# EAGLE design MedidorEnergia (EAGLE 7.7.0)
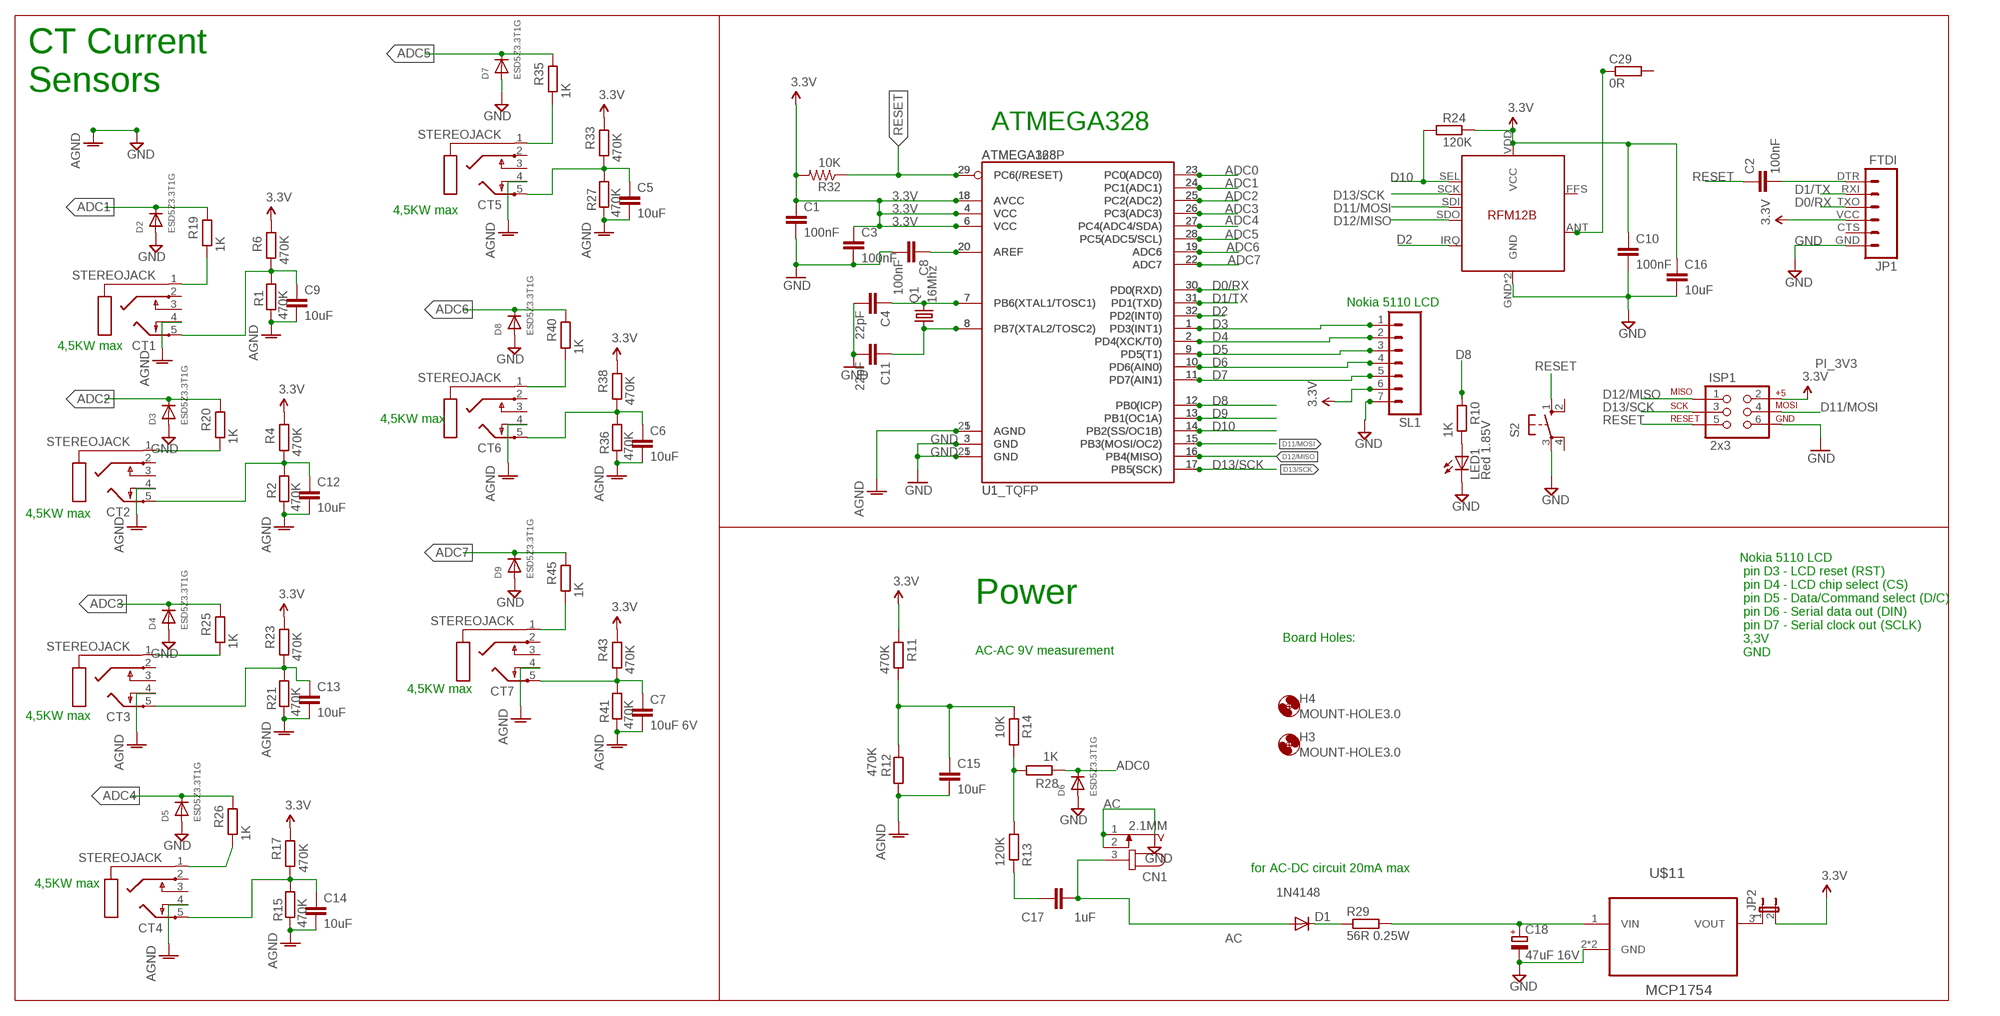
[diagram p0: schematic, sheet 1]

## Parts
C1  100nF  C-EUC0603  [C0603]
C2  100nF  C-EUC0603  [C0603]
C3  100nF  C-EUC0603  [C0603]
C4  22pF  C-EUC0603  [C0603]
C5  10uF  C-EUC0805  [C0805]
C6  10uF  C-EUC0805  [C0805]
C7  10uF 6V  C-EUC0805  [C0805]
C8  100nF  C-EUC0603  [C0603]
C9  10uF  C-EUC0805  [C0805]
C10  100nF  C-EUC0603  [C0603]
C11  22pF  C-EUC0603  [C0603]
C12  10uF  C-EUC0805  [C0805]
C13  10uF  C-EUC0805  [C0805]
C14  10uF  C-EUC0805  [C0805]
C15  10uF  C-EUC1206  [C1206]
C16  10uF  C-EUC1206  [C1206]
C17  1uF  C-EUC0805  [C0805]
C18  47uF 16V  CPOL-EUD  [PANASONIC_D]
C29  0R  R-EU_R0603  [R0603]
CN1  2.1MM  JACK-PLUG0  [SPC4077]
CT1  STEREOJACK  [STX3100]
CT2  STEREOJACK  [STX3100]
CT3  STEREOJACK  [STX3100]
CT4  STEREOJACK  [STX3100]
CT5  STEREOJACK  [STX3100]
CT6  STEREOJACK  [STX3100]
CT7  STEREOJACK  [STX3100]
D1  1N4148  DIODESOD  [SOD-323]
D2  ESD5Z3.3T1G  DIODESOD-523  [SOD-523]
D3  ESD5Z3.3T1G  DIODESOD-523  [SOD-523]
D4  ESD5Z3.3T1G  DIODESOD-523  [SOD-523]
D5  ESD5Z3.3T1G  DIODESOD-523  [SOD-523]
D6  ESD5Z3.3T1G  DIODESOD-523  [SOD-523]
D7  ESD5Z3.3T1G  DIODESOD-523  [SOD-523]
D8  ESD5Z3.3T1G  DIODESOD-523  [SOD-523]
D9  ESD5Z3.3T1G  DIODESOD-523  [SOD-523]
H3  MOUNT-HOLE3.0  [3,0]
H4  MOUNT-HOLE3.0  [3,0]
ISP1  2x3  AVR_SPI_PRG_6PTH  [2X3]
JP1  FTDI  FTDI_BASICPTH  [FTDI_BASIC]
JP2  JUMPER-2PTH_LOCK  [1X02_LOCK]
LED1  Red 1.85V  LEDCHIP-LED0805  [CHIP-LED0805]
Q1  16Mhz  CRYSTALHC49S  [HC49/S]
R1  470K  R-EU_R0603  [R0603]
R2  470K  R-EU_R0603  [R0603]
R4  470K  R-EU_R0603  [R0603]
R6  470K  R-EU_R0603  [R0603]
R10  1K  R-EU_R0603  [R0603]
R11  470K  R-EU_R0603  [R0603]
R12  470K  R-EU_R0603  [R0603]
R13  120K  R-EU_R0603  [R0603]
R14  10K  R-EU_R0603  [R0603]
R15  470K  R-EU_R0603  [R0603]
R17  470K  R-EU_R0603  [R0603]
R19  1K  R-EU_R0603  [R0603]
R20  1K  R-EU_R0603  [R0603]
R21  470K  R-EU_R0603  [R0603]
R23  470K  R-EU_R0603  [R0603]
R24  120K  R-EU_R0603  [R0603]
R25  1K  R-EU_R0603  [R0603]
R26  1K  R-EU_R0603  [R0603]
R27  470K  R-EU_R0603  [R0603]
R28  1K  R-EU_R0603  [R0603]
R29  56R 0.25W  R-EU_R1206  [R1206]
R32  10K  R-US_R0603  [R0603]
R33  470K  R-EU_R0603  [R0603]
R35  1K  R-EU_R0603  [R0603]
R36  470K  R-EU_R0603  [R0603]
R38  470K  R-EU_R0603  [R0603]
R40  1K  R-EU_R0603  [R0603]
R41  470K  R-EU_R0603  [R0603]
R43  470K  R-EU_R0603  [R0603]
R45  1K  R-EU_R0603  [R0603]
S2  10-XX  [B3F-10XX]
SL1  M07  [07P]
U1  ATMEGA168  [TQFP32-08]
U1_TQFP  ATMEGA328P  ATMEGA328_SMT  [TQFP32-08]
U$11  MCP1754  [SOT89]
U$14  RFM12B  [RFM12B]

## Nets
3.3V: C1.1 C3.1 C10.1 C16.1 ISP1.2 JP1.VCC JP2.2 R4.2 R6.2 R11.2 R17.2 R23.2 R24.2 R32.2 R33.2 R38.2 R43.2 SL1.6 U1.4(VCC) U1.6(VCC) U1.18(AVCC) U1_TQFP.4(VCC) U1_TQFP.6(VCC) U1_TQFP.18(AVCC) U$14.VDD(VCC)
AC: C17.2 CN1.3 D1.2(A)
ADC0: D6.K(C) R28.1 U1.23(PC0(ADC0)) U1_TQFP.23(PC0(ADC0))
ADC1: D2.K(C) R19.2 U1.24(PC1(ADC1)) U1_TQFP.24(PC1(ADC1))
ADC2: D3.K(C) R20.2 U1.25(PC2(ADC2)) U1_TQFP.25(PC2(ADC2))
ADC3: D4.K(C) R25.2 U1.26(PC3(ADC3)) U1_TQFP.26(PC3(ADC3))
ADC4: D5.K(C) R26.2 U1.27(PC4(ADC4/SDA)) U1_TQFP.27(PC4(ADC4/SDA))
ADC5: D7.K(C) R35.2 U1.28(PC5(ADC5/SCL)) U1_TQFP.28(PC5(ADC5/SCL))
ADC6: D8.K(C) R40.2 U1.19(ADC6) U1_TQFP.19(ADC6)
ADC7: D9.K(C) R45.2 U1.22(ADC7) U1_TQFP.22(ADC7)
AGND [gnd]: C5.2 C6.2 C7.2 C9.2 C12.2 C13.2 C14.2 C15.2 CT1.4 CT2.4 CT3.4 CT4.4 CT5.4 CT6.4 CT7.4 R1.2 R2.2 R12.1 R15.2 R21.2 R27.2 R36.2 R41.2 U1.5(AGND) U1_TQFP.21(AGND)
D0/RX: JP1.TXO U1.30(PD0(RXD)) U1_TQFP.30(PD0(RXD))
D1/TX: JP1.RXI U1.31(PD1(TXD)) U1_TQFP.31(PD1(TXD))
D2: U1.32(PD2(INT0)) U1_TQFP.32(PD2(INT0)) U$14.IRQ
D3: SL1.1 U1.1(PD3(INT1)) U1_TQFP.1(PD3(INT1))
D4: SL1.2 U1.2(PD4(XCK/T0)) U1_TQFP.2(PD4(XCK/T0))
D5: SL1.3 U1.9(PD5(T1)) U1_TQFP.9(PD5(T1))
D6: SL1.4 U1.10(PD6(AIN0)) U1_TQFP.10(PD6(AIN0))
D7: SL1.5 U1.11(PD7(AIN1)) U1_TQFP.11(PD7(AIN1))
D8: R10.2 U1.12(PB0(ICP)) U1_TQFP.12(PB0(ICP))
D9: U1.13(PB1(OC1A)) U1_TQFP.13(PB1(OC1A))
D10: R24.1 U1.14(PB2(SS/OC1B)) U1_TQFP.14(PB2(SS/OC1B)) U$14.SEL
D11/MOSI: ISP1.4 U1.15(PB3(MOSI/OC2)) U1_TQFP.15(PB3(MOSI/OC2)) U$14.SDI
D12/MISO: ISP1.1 U1.16(PB4(MISO)) U1_TQFP.16(PB4(MISO)) U$14.SDO
D13/SCK: ISP1.3 U1.17(PB5(SCK)) U1_TQFP.17(PB5(SCK)) U$14.SCK
GND [gnd]: C1.2 C3.2 C4.2 C8.2 C10.2 C11.2 C16.2 C18.- CN1.1 CN1.2 D2.A D3.A D4.A D5.A D6.A D7.A D8.A D9.A ISP1.6 JP1.GND LED1.C S2.3(P) SL1.7 U1.3(GND) U1.21(GND) U1_TQFP.3(GND) U1_TQFP.5(GND) U$11.2(GND) U$11.2.1(GND) U$14.GND U$14.P$12(GND) ; supply symbol labelled AGND
N$1: C4.1 Q1.2 U1.7(PB6(XTAL1/TOSC1)) U1_TQFP.7(PB6(XTAL1/TOSC1))
N$2: CT1.1 R19.1
N$3: C13.1 CT3.5 R21.1 R23.1
N$4: R13.2 R14.1 R28.2
N$5: JP2.1 U$11.3(VOUT)
N$6: C18.+ R29.2 U$11.1(VIN)
N$7: C17.1 R13.1
N$8: CT4.1 R26.1
N$9: C11.1 Q1.1 U1.8(PB7(XTAL2/TOSC2)) U1_TQFP.8(PB7(XTAL2/TOSC2))
N$10: CT2.1 R20.1
N$11: C29.1 U$14.ANT
N$12: D1.1(C) R29.1
N$13: CT3.1 R25.1
N$17: C5.1 CT5.5 R27.1 R33.1
N$18: CT5.1 R35.1
N$20: C8.1 U1.20(AREF) U1_TQFP.20(AREF)
N$21: C6.1 CT6.5 R36.1 R38.1
N$22: CT6.1 R40.1
N$23: C2.2 JP1.DTR
N$25: C7.1 CT7.5 R41.1 R43.1
N$26: CT7.1 R45.1
N$33: C12.1 CT2.5 R2.1 R4.1
N$34: C15.1 R11.1 R12.2 R14.2
N$37: C14.1 CT4.5 R15.1 R17.1
N$38: C9.1 CT1.5 R1.1 R6.1
N$41: LED1.A R10.1
RESET: C2.1 ISP1.5 R32.1 S2.1(S) U1.29(PC6(/RESET)) U1_TQFP.29(PC6(/RESET))
Unconnected: C29.2 CT1.2 CT1.3 CT2.2 CT2.3 CT3.2 CT3.3 CT4.2 CT4.3 CT5.2 CT5.3 CT6.2 CT6.3 CT7.2 CT7.3 JP1.CTS S2.2(S1) S2.4(P1) U$14.FFS

## Notes on the sheet
- CT Current 
  Sensors
- ATMEGA328
- 4,5KW max
- Nokia 5110 LCD
- 4,5KW max
- 4,5KW max
- 4,5KW max
- Power
- Board Holes:
- AC-AC 9V measurement
- Nokia 5110 LCD
   pin D3 - LCD reset (RST)
   pin D4 - LCD chip select (CS)
   pin D5 - Data/Command select (D/C)
   pin D6 - Serial data out (DIN)
   pin D7 - Serial clock out (SCLK)
   3,3V
   GND
- 4,5KW max
- 4,5KW max
- for AC-DC circuit 20mA max
- 4,5KW max

## Library data of the parts
C1 C2 C10 = rcl:C-EU: CAPACITOR, European symbol; MF: YAGEO (PHYCOMP); MPN: CC0603MRY5V9BB104; OC_FARNELL: 431989
C3 C8 = resistor:C-EU: CAPACITOR, European symbol; MF: YAGEO (PHYCOMP); MPN: CC0603MRY5V9BB104; OC_FARNELL: 431989
C4 C11 = resistor:C-EU: CAPACITOR, European symbol; MF: YAGEO (PHYCOMP); MPN: CC0603JRNPO9BN220; OC_FARNELL: 722005
C5-C7 C9 C12-C15 = resistor:C-EU: CAPACITOR, European symbol; MF: AVX; MPN: TAJC106K025RNJ; OC_FARNELL: 197518
C16 = rcl:C-EU: CAPACITOR, European symbol; MF: AVX; MPN: TAJC106K025RNJ; OC_FARNELL: 197518
C17 = resistor:C-EU: CAPACITOR, European symbol; MF: AVX; MPN: 08055C104KAT2A; OC_FARNELL: 499687
C18 = resistor:CPOL-EU: POLARIZED CAPACITOR, European symbol; MF: PANASONIC ELECTRONIC COMPONENTS; MPN: EEEFC1C470AP; OC_FARNELL: 1244352
C29 = resistor:R-EU_: RESISTOR, European symbol; OC_FARNELL: unknown
CN1 = con-jack:JACK-PLUG: DC POWER JACK Power Jack, DC, Right Angle, Through Hole, Rated 5A at 16VDC, PC Terminals Distributor: Farnell (www.Farnell.de) Drawing: 84N1161.pdf / 84N1162.pdf Manufacturer: SPC Technology (www.spctechnology.com) Type: SPC4077 / SPC 4078; MF: MULTICOMP; MPN: SPC21364; OC_FARNELL: 1654842; OC_NEWARK: unknown
CT1-CT7 = adafruit:STEREOJACK: MIC/HEADPHONE JACK Stereo jack with two switches. Kycon STX3100, CUI SJ1-3555NG and/or 4UCon 05544; MF: CLIFF ELECTRONIC COMPONENTS; MPN: FC68131; OC_FARNELL: 2518188
D1 = SparkFun:DIODE: Diode; MF: MULTICOMP; MPN: 1N4148WS.; OC_FARNELL: 1466524
D2-D9 = microbuilder:DIODE: Diode; MF: ON SEMICONDUCTOR; MPN: ESD5Z3.3T1G; OC_FARNELL: 2317508
H3 H4 = holes:MOUNT-HOLE: MOUNTING HOLE with drill center marker; OC_FARNELL: unknown
ISP1 = SparkFun:AVR_SPI_PRG_6: AVR ISP 6 Pin This is the reduced ISP connector for AVR programming. Common on Arduino. This footprint will take up less PCB space and can be used with a 10-pin to 6-pin adapter such as SKU: BOB-08508; MF: HARWIN; MPN: M20-9970346; OC_FARNELL: 1022226
JP1 = SparkFun:FTDI_BASIC: FTDI Basic: 3.3V and 5V; MF: MULTICOMP; MPN: 2212S-10SG-85; OC_FARNELL: 1593464
JP2 = SparkFun:JUMPER-2: Jumper Basic 0.1" spaced jumper. Use with breakaway headers.; OC_FARNELL: unknown
LED1 = adafruit:LED: LED OSRAM: - CHIPLED LG R971, LG N971, LY N971, LG Q971, LY Q971, LO R971, LY R971 LH N974, LH R974 LS Q976, LO Q976, LY Q976 LO Q996 - Hyper CHIPLED LW Q18S LB Q993, LB Q99A, LB R99A - SideLED LS A670, LO A670, LY A670, LG A670, LP A670 LB A673, LV A673, LT A673, LW A673 LH A674 LY A675 LS A676, LA A676, LO A676, LY A676, LW A676 LS A679, LY A679, LG A679 - Hyper Micro SIDELED® LS Y876, LA Y876, LO Y876, LY Y876 LT Y87S - SmartLED LW L88C, LW L88S LB L89C, LB L89S, LG L890 LS L89K, LO L89K, LY L89K LS L896, LA L896, LO L896, LY L896 - TOPLED LS T670, LO T670, LY T670, LG T670, LP T670 LSG T670, LSP T670, LSY T670, LOP T670, LYG T670 LG T671, LOG T671, LSG T671 LB T673, LV T673, LT T673, LW T673 LH T674 LS T676, LA T676, LO T676, LY T676, LB T676, LH T676, LSB T676, LW T676 LB T67C, LV T67C, LT T67C, LS T67K, LO T67K, LY T67K, LW E67C LS E67B, LA E67B, LO E67B, LY E67B, LB E67C, LV E67C, LT E67C LW T67C LS T679, LY T679, LG T679 LS T770, LO T770, LY T770, LG T770, LP T770 LB T773, LV T773, LT T773, LW T773 LH T774 LS E675, LA E675, LY E675, LS T675 LS T776, LA T776, LO T776, LY T776, LB T776 LHGB T686 LT T68C, LB T68C - Hyper Mini TOPLED® LB M676 - Mini TOPLED Santana® LG M470 LS M47K, LO M47K, LY M47K Source: http://www.osram.convergy.de/; MF: MULTICOMP; MPN: MCL-S270SRC; OC_FARNELL: 1581239
Q1 = adafruit:CRYSTAL: CRYSTAL; MF: MULTICOMP; MPN: HC49SM-3.6864-30-50-60-16-ATF; OC_FARNELL: 1667008; OC_NEWARK: unknown
R1 R2 R4 R6 R11 R12 R15 R17 R21 R23 R27 R33 R36 R38 R41 R43 = rcl:R-EU_: RESISTOR, European symbol; MF: YAGEO (PHYCOMP); MPN: RE0603DR-07470KL; OC_FARNELL: 1840598
R10 R19 R20 R25 R26 R28 R35 R40 R45 = rcl:R-EU_: RESISTOR, European symbol; MF: WELWYN; MPN: PCF0603R-1K0BT1; OC_FARNELL: 1160322
R13 R24 = rcl:R-EU_: RESISTOR, European symbol; MF: YAGEO (PHYCOMP); MPN: RT0603FRE07120KL; OC_FARNELL: 1500592
R14 = rcl:R-EU_: RESISTOR, European symbol; MF: WELWYN; MPN: PCF0603R-10KBT1; OC_FARNELL: 1160359
R29 = resistor:R-EU_: RESISTOR, European symbol; MF: VISHAY; MPN: CRCW120656R0JNEA; OC_FARNELL: 1570837
R32 = adafruit:R-US_: RESISTOR, American symbol; MF: WELWYN; MPN: PCF0603R-10KBT1; OC_FARNELL: 1160359
S2 = switch-omron:10-XX: OMRON SWITCH; MF: OMRON ELECTRONIC COMPONENTS; MPN: B3F-1000; OC_FARNELL: 176432; OC_NEWARK: 36M3542
SL1 = con-amp-quick:M07: AMP QUICK CONNECTOR; MF: HARWIN; MPN: M20-9991045; OC_FARNELL: 1022259; OC_NEWARK: unknown
U1 = SparkFun-DigitalIC:ATMEGA168: Atmel 32-pin 8-bit micro, 16k flash.; OC_FARNELL: unknown
U1_TQFP = SparkFun-DigitalIC:ATMEGA328_SMT: 32-Pin Atmega328 part Commonly used on Arduino compatible boards Available in QFP and QFN packages TQFP is IC-09069 QFN is non-stock; OC_FARNELL: unknown; PROD_ID: IC-09069
U$11 = OpenEnergyMonitor:MCP1754; MF: MICROCHIP; MPN: MCP1754ST-3302E/MB; OC_FARNELL: 2065847
U$14 = JeeParts:RFM12B; OC_FARNELL: unknown

## Net classes
0 default: width 0.203 mm, drill 0.6 mm, clearance 0.203 mm
1 power: width 0.305 mm, drill 0.6 mm, clearance 0.254 mm
2 gnd: width 0.254 mm, drill 0.6 mm, clearance 0.254 mm

## Board
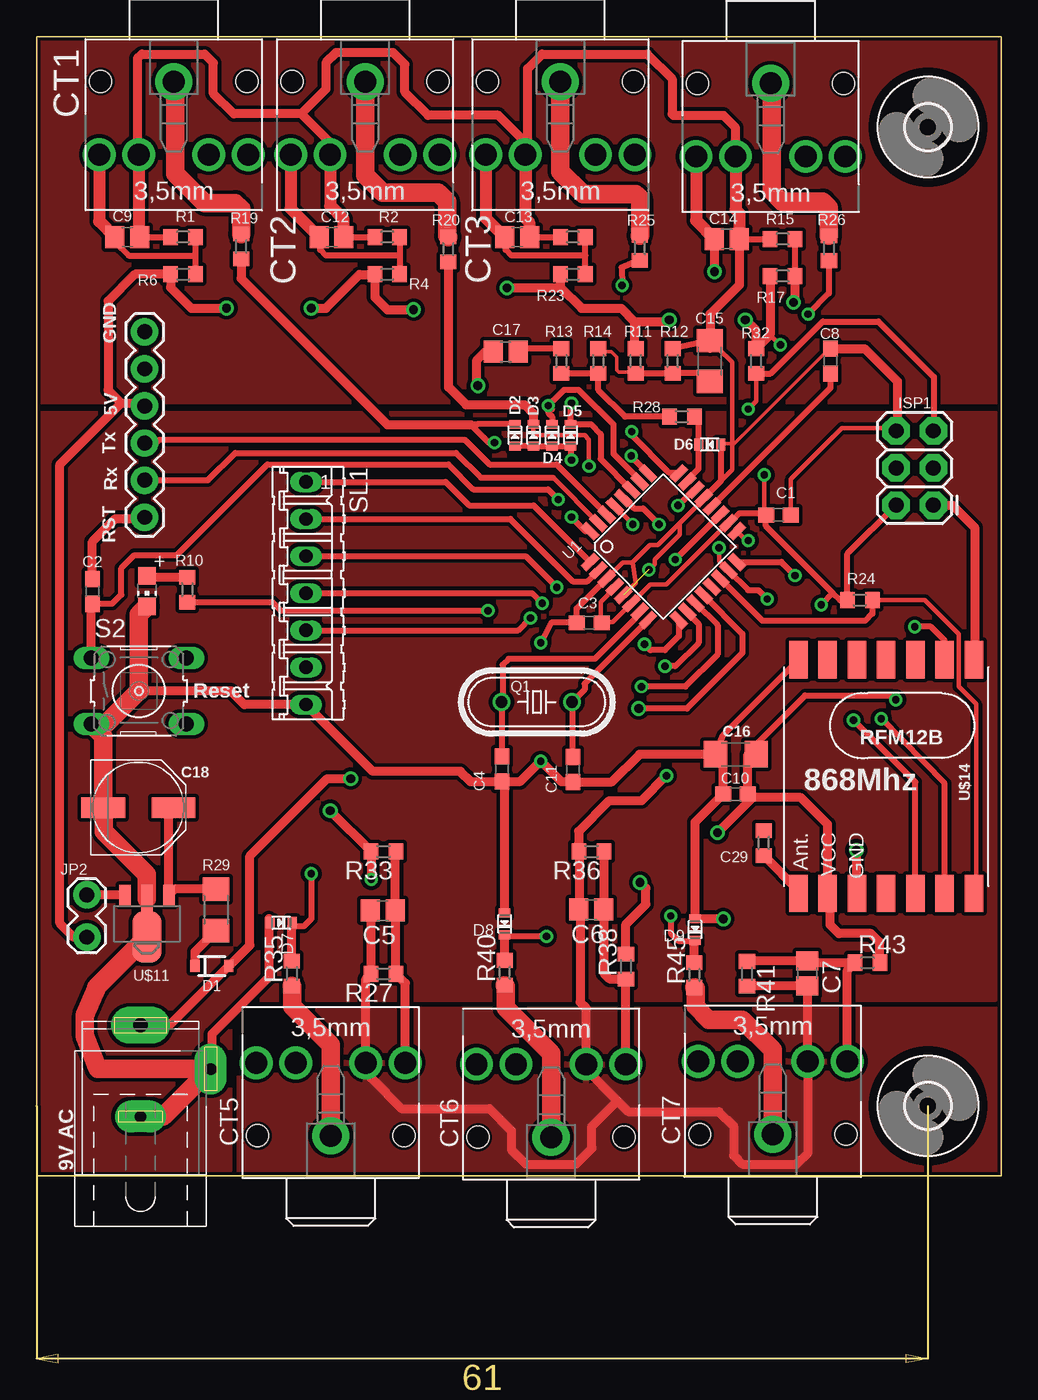
[diagram p1: board, top side]
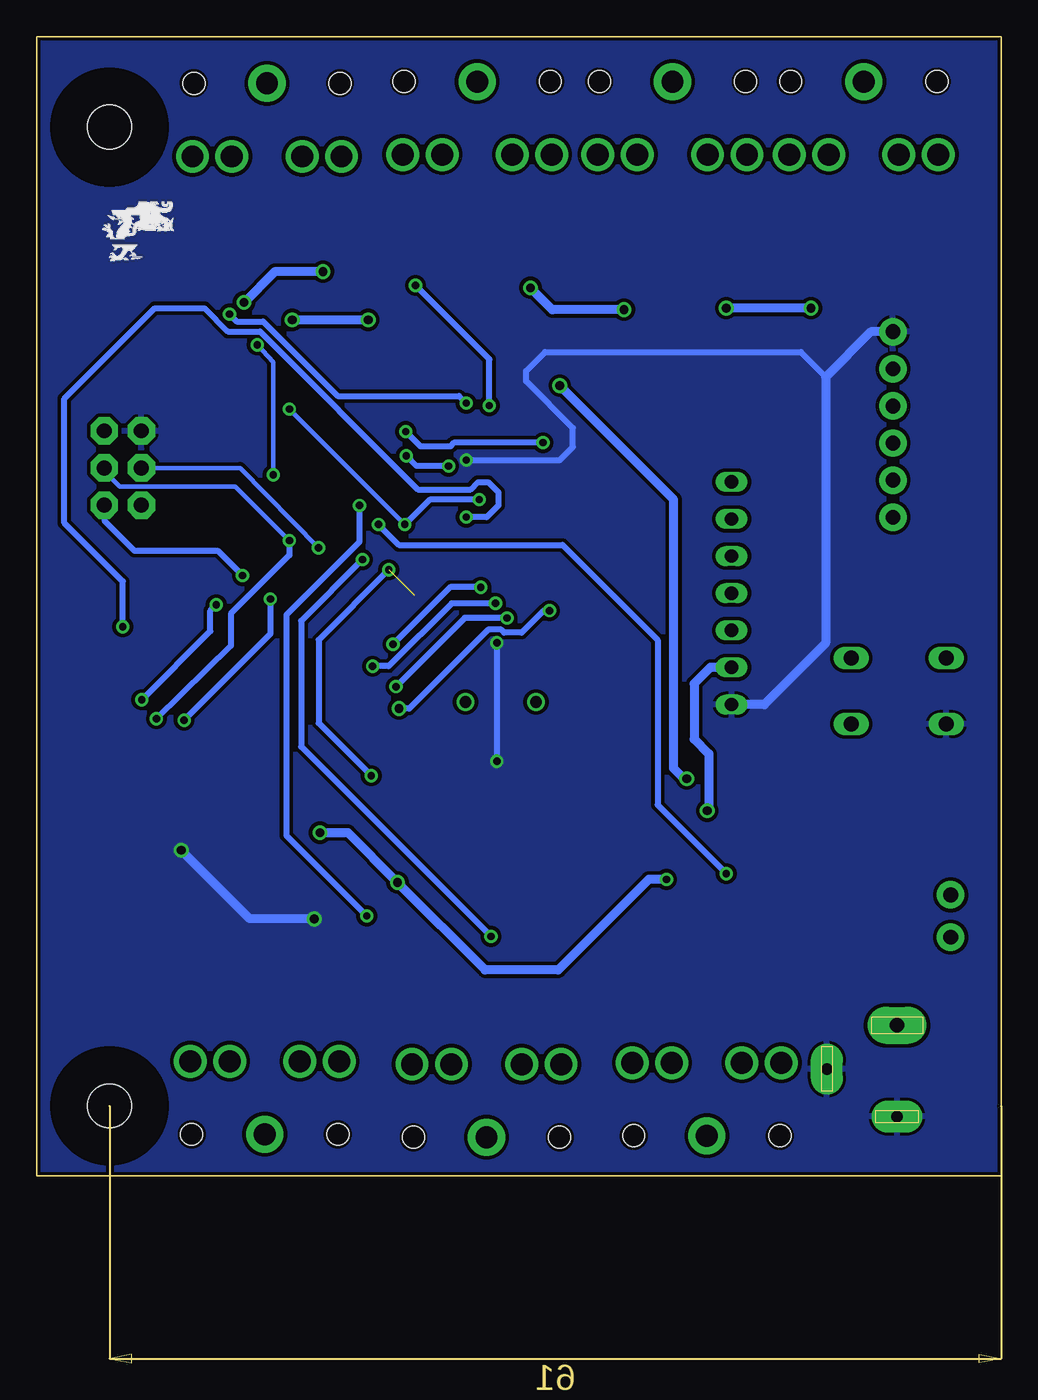
[diagram p2: board, bottom side, seen from below]

Size 66 x 78 mm. Coordinates in mm from the lower left corner, seen from the top.
Outline: 0,78 0,0 66,0 66,78 0,78
Copper layers (1*16): Top 0.035mm / dielectric 1.5mm / Bottom 0.035mm
Design rules "default *": minimum track width 8mil, minimum drill 0.5mm, track to track 8mil, track to pad 8mil, pad to pad 8mil, via to via 10mil, smd to smd 7mil, copper to edge 8mil, drill to drill 8mil, minimum pad ring 8mil, minimum via ring 8mil, stop-mask expansion 0.075mm, vias tented up to drill 0.6mm, thermal gap 8mil

### Footprints (pad centres in the part's own frame; a part is rotated, then mirrored left to right if it is on the bottom)
C0603 = smd 1.1 x 1: 1 -0.85,0; 2 0.85,0
C0805 = smd 1.3 x 1.5: 1 -0.85,0; 2 0.85,0
C1206 = smd 1.6 x 1.8: 1 -1.4,0; 2 1.4,0
PANASONIC_D = smd 3 x 1.4: + 2.4,0; - -2.4,0
R0603 = smd 1 x 1.1: 1 -0.85,0; 2 0.85,0
SPC4077 = drill 0.8 pad 2.184 long: 1 -3.25,0; 2 0,-4.8 | drill 1 pad 2.54 long: 3 3,0
STX3100 = drill 1.5 pad 2.54: 1 2.7,-0.1 | drill 1.5: 2 7.7,5; 3 7.7,2.3; 4 7.7,-2.5; 5 7.7,-5.2 | hole 1.5: 2.7,4.9; 2.7,-5.1
SOD-323 = smd 0.63 x 0.83: 1 -1.15,0; 2 1.15,0
SOD-523 = smd 0.8 x 0.6: A 0,-0.75; K 0,0.75
3,0 = hole 3: 0,0
2X3 = drill 1.016 pad 1.88 octagon: 1 0,0; 2 0,2.54; 3 2.54,0; 4 2.54,2.54; 5 5.08,0; 6 5.08,2.54
FTDI_BASIC = drill 1.016 pad 1.88: CTS 10.16,0; DTR 0,0; GND 12.7,0; RXI 2.54,0; TXO 5.08,0; VCC 7.62,0
1X02_LOCK = drill 1.016 pad 1.88: 1 -0.178,0; 2 2.718,0
CHIP-LED0805 = smd 1.2 x 1.2: A 0,-1.05; C 0,1.05
HC49/S = drill 0.813: 1 -2.413,0; 2 2.413,0
R1206 = smd 1.6 x 1.803: 1 -1.422,0; 2 1.422,0
B3F-10XX = drill 1.016 long: 1 -3.251,2.261; 2 3.251,2.261; 3 -3.251,-2.261; 4 3.251,-2.261
07P = drill 0.914 long: 1 -7.62,0; 2 -5.08,0; 3 -2.54,0; 4 0,0; 5 2.54,0; 6 5.08,0; 7 7.62,0
TQFP32-08 = smd 1.27 x 0.559: 1 -4.293,2.8; 2 -4.293,2; 3 -4.293,1.2; 4 -4.293,0.4; 5 -4.293,-0.4; 6 -4.293,-1.2; 7 -4.293,-2; 8 -4.293,-2.8; 17 4.293,-2.8; 18 4.293,-2; 19 4.293,-1.2; 20 4.293,-0.4; 21 4.293,0.4; 22 4.293,1.2; 23 4.293,2; 24 4.293,2.8 | smd 0.559 x 1.27: 9 -2.8,-4.293; 10 -2,-4.293; 11 -1.2,-4.293; 12 -0.4,-4.293; 13 0.4,-4.293; 14 1.2,-4.293; 15 2,-4.293; 16 2.8,-4.293; 25 2.8,4.293; 26 2,4.293; 27 1.2,4.293; 28 0.4,4.293; 29 -0.4,4.293; 30 -1.2,4.293; 31 -2,4.293; 32 -2.8,4.293
SOT89 = smd 0.8 x 1.4: 1 -1.499,-1.981; 3 1.499,-1.981 | smd 0.8 x 1.9: 2 0,-1.727 | smd 2 x 3.5: 2.1 0,0.889
RFM12B = smd 2.54 x 1.27: ANT 8,-6; FFS -8,2; GND 8,-2; IRQ -8,4; P$8 -8,0; P$9 -8,-2; P$10 -8,-4; P$12 -8,-6; P$16 8,0; SCK 8,4; SDI 8,2; SDO -8,6; SEL 8,6; VDD 8,-4

### Placement (x,y rotation side)
C1  50.77,45.24 0 top
C2  3.83,40.02 90 top
C3  37.81,37.88 180 top
C4  31.84,27.86 270 top
C5  23.69,18.17 180 top
C6  37.97,18.24 180 top
C7  52.73,13.87 270 top
C8  54.33,55.78 90 top
C9  6.22,64.27 0 top
C10  47.83,26.15 180 top
C11  36.72,27.82 270 top
C12  20.19,64.27 0 top
C13  32.89,64.27 0 top
C14  47.24,64.14 0 top
C15  46.07,55.79 90 top
C16  47.85,28.86 180 top
C17  32.1,56.42 180 top
C18  6.97,25.22 0 top
C29  49.75,22.79 90 top
CN1  7.12,7.32 90 top
CT1  9.49,77.62 270 top
CT2  22.58,77.62 270 top
CT3  35.95,77.62 270 top
CT4  50.33,77.49 270 top
CT5  20.03,0.05 90 top
CT6  35.11,-0.05 90 top
CT7  50.28,0.15 90 top
D1  12,14.38 0 top
D2  32.73,50.7 0 top
D3  34.01,50.7 0 top
D4  35.27,50.7 0 top
D5  36.55,50.7 0 top
D6  46.07,50.07 90 top
D7  16.75,17.33 270 top
D8  32.03,17.25 180 top
D9  45.06,16.87 180 top
H3  61,71.8 0 top
H4  61,4.8 0 top
ISP1  61.37,45.92 90 top
JP1  7.4,45.09 90 top
JP2  3.45,19.07 270 top
LED1  7.56,40.03 180 top
Q1  34.23,32.44 180 top
R1  10.03,64.27 180 top
R2  24,64.27 180 top
R4  24,61.73 180 top
R6  10.03,61.73 180 top
R10  10.32,40.12 270 top
R11  40.99,55.79 90 top
R12  43.53,55.79 270 top
R13  35.91,55.79 270 top
R14  38.45,55.79 90 top
R15  51.05,64.14 180 top
R17  51.05,61.6 180 top
R19  14,63.63 270 top
R20  28.17,63.43 270 top
R21  36.7,64.27 180 top
R23  36.7,61.73 180 top
R24  56.34,39.42 180 top
R25  41.27,63.53 270 top
R26  54.23,63.5 270 top
R27  23.74,13.84 180 top
R28  44.16,51.98 180 top
R29  12.28,18.22 90 top
R32  49.24,55.78 90 top
R33  23.74,22.21 180 top
R35  17.48,13.85 90 top
R36  37.97,22.21 180 top
R38  40.34,14.33 90 top
R40  32.03,13.91 90 top
R41  48.62,13.84 270 top
R43  56.86,14.6 0 top
R45  45.02,13.76 90 top
S2  7,33.2 0 top
SL1  18.44,39.89 270 top
U1  42.9,43.09 45 top
U1_TQFP  42.9,43.09 45 top
U$11  7.55,17.25 180 top
U$14  58.14,27.34 270 top

### Tracks (layer width: path | path; a pad name or v marks a point on that pad's centre or on a via)
3.3V  (via drill 0.5, 0.6)
  Top 0.305: 49.79,45.37 v49.79,47.99 v49.8,48 | v50.9,56.9 50.39,57.4 50.2,57.59 | 38.7,37.92 39.42,37.92 U1.6 42.01,40.5 43.1,40.5 47.31,44.71 | U1.4 39.58,40.28 38.6,39.3 38.6,37.94 C3.1
  Top 0.406: 38.7,37.92 C3.1 | ISP1.2 55.49,42.59 R24.2 54.98,39.42 54.5,39.9 | 54.5,39.9 49.9,44.5 49.9,45.23 C1.1 49.79,45.37 48.1,45.37 47.44,44.71 U1.18 47.31,44.71 | C16.1 48.7,29 52.6,32.9 58.5,32.9 v58.8,32.6 | 54.5,39.9 v53.7,39.1 | v22.89,20.31 v22.9,20.3
  Top 0.61: R17.2 50.2,57.59 R32.2 49.24,57.85 v48.5,58.6 | C16.1 48.68,28.84 C10.1 48.93,25.9 | R43.2 57.71,15.99 57.1,16.6 54.9,16.6 54.3,17.2 54.3,19.17 U$14.VDD 54.13,24.07 52.3,25.9 48.93,25.9 | 5.8,52.9 4.9,53.8 4.9,59.9 6.73,61.73 R6.2 9.18,60.82 10.6,59.4 v13,59.4 | 5.8,52.9 7.2,52.9 JP1.VCC | JP2.2 2.55,16.35 1.6,17.3 1.6,48.7 5.8,52.9 | v18.8,59.4 19.8,59.4 22.1,61.7 23.12,61.7 R4.2 23.15,60.15 24,59.3 v25.8,59.3 | R23.2 35.85,60.85 | 35.85,60.85 37.3,59.4 40,59.4 40.9,58.5 | 40.9,58.5 40.9,56.73 R11.2 | v32.2,60.8 35.8,60.8 35.85,60.85 | 40.9,58.5 43.2,58.5 v43.3,58.6 | v20.1,25 R33.2 v22.89,20.31 | 48.93,25.9 48.93,25.83 v46.6,23.5 | R38.2 40.34,17.24 41.7,18.6 41.7,19.7 v41.3,20.1
  Bottom 0.305: v49.8,48 49.8,55.7 v50.9,56.9
  Bottom 0.406: v58.8,32.6 54.1,37.3 54.1,38.7 v53.7,39.1
  Bottom 0.61: v13,59.4 v18.8,59.4 | v25.8,59.3 30.7,59.3 v32.2,60.8 | v43.3,58.6 v48.5,58.6 | v22.9,20.3 24.1,20.3 30.3,14.1 35.3,14.1 v41.3,20.1 44.7,23.5 v46.6,23.5 | SL1.6 19.89,34.81 21,33.7 21,29.9 20,28.9 20,25.1 v20.1,25
AC  (via drill 0.6)
  Top 0.61: CN1.3 9.09,10.32 D1.2 13.18,14.38 14.6,15.8 14.6,21.9 19.9,27.2 v21.5,27.2 | C17.2 30.72,56.42 30.1,55.8 30.1,54.2 v30.2,54.1
  Bottom 0.61: v21.5,27.2 21.7,27.2 22.4,27.9 22.4,46.3 v30.2,54.1
ADC0
  Top 0.406: U1.23 44.52,47.63 45.31,48.42 45.31,50.06 D6.K 45.32,51.67 R28.1
ADC1  (via drill 0.5)
  Top 0.406: v40.74,50.96 40.74,50.7 43.28,48.16 43.89,48.16 U1.24 | D2.K 30.18,51.45 29.74,51.41 30.96,50.2 v31.34,50.2
  Top 0.61: 29.74,51.41 24.03,51.41 14,61.44 R19.2
  Bottom 0.406: v31.34,50.2 37.43,50.2 37.69,49.94 39.72,49.94 v40.74,50.96
ADC2  (via drill 0.5)
  Top 0.305: D3.K 34.01,50.7 34,50.7 37.5,50.7 37.8,50.4 v37.8,48.6
  Top 0.406: v40.7,49.3 40.7,49.24 U1.25
  Top 0.61: D3.K 34,52.2 33.4,52.8 29.4,52.8 28.2,54 28.2,62.56 R20.2
  Bottom 0.406: v37.8,48.6 40,48.6 v40.7,49.3
ADC3  (via drill 0.5)
  Top 0.406: U1.26 41.27,47.63 39.47,49.44 39.47,51.47 38.45,52.48 38.32,52.58 37.1,53.8 36.08,53.8 v35.02,52.74 | R25.2 40.05,62.19 v40.07,60.97 | v35.02,52.74 35.02,52.23 35.27,51.98 D4.K | 35.27,52.48 v35.02,52.74
  Bottom 0.406: v40.07,60.97 36.67,57.56 35.02,55.91 v35.02,52.74
ADC4  (via drill 0.5)
  Top 0.406: U1.27 38.6,49.08 38.6,50.8 37.95,51.45 D5.K 36.55,52.84 v36.6,52.9 | R26.2 54.23,60.42 v52.8,59
  Bottom 0.406: v52.8,59 52.3,58.5 50.5,58.5 45.4,53.4 37.1,53.4 v36.6,52.9
ADC5  (via drill 0.5)
  Top 0.305: 17.33,17.1 D7.K
  Top 0.406: v18.8,20.7 18.8,17.6 18.3,17.1 17.33,17.1 | U1.28 40.2,46.4 40.9,45.7 41.5,45.7 v42.6,44.6
  Top 0.61: R35.2 17.48,16.96 D7.K
  Bottom 0.406: v42.6,44.6 41.2,43.2 30,43.2 23.5,36.7 23.5,25.4 v18.8,20.7
ADC6  (via drill 0.5)
  Top 0.406: U1.19 v43.7,42.2 | v34.9,16.4 32.13,16.4 D8.K
  Top 0.61: R40.2 D8.K
  Bottom 0.406: v43.7,42.2 47.9,38 47.9,29.4 v34.9,16.4
ADC7  (via drill 0.5)
  Top 0.305: U1.22
  Top 0.406: U1.22 44.97,46.97 v43.9,45.9 | v43.4,17.8 43.4,16.6 43.9,16.1 45.04,16.1 D9.K
  Top 0.61: R45.2 45.02,16.08 D9.K
  Bottom 0.406: v43.9,45.9 43.9,43.4 48.9,38.4 48.9,23.3 v43.4,17.8
AGND  (via drill 0.5)  (1 unrouted)
  Top 0.305: 46.36,56.64 C15.2 46.66,56.64 47.6,55.7 47.6,48.36 U1_TQFP.21 | 45.65,46.35 44,44.7 44,43.9 42.3,42.2 42.3,41.9 v41.9,41.5
  Top 0.406: C15.2 R12.1 | C14.2 R15.2 | C9.2 R1.2 | C13.2 R21.2 | C12.2 R2.2 | U1_TQFP.21 45.65,46.35 | U1.5 40.17,39.77
  Top 0.61: C14.2 48.09,60.99 46.1,59 46.1,56.67 C15.2 | R41.2 48.65,13.02 C7.2 52.78,12.97 CT7.4 52.8,7.84 52.8,1.6 52,0.8 48.3,0.8 47.7,1.4 47.7,3.4 46.7,4.4 40.5,4.4 39.75,5.15 | C5.2 22.89,18.12 R27.2 22.53,13.48 CT5.4 22.89,7.39 22.89,6.71 25,4.6 31,4.6 32.5,3.1 32.5,1.8 33.5,0.8 36.9,0.8 38,1.9 38,3.4 39.75,5.15 | 39.75,5.15 37.61,7.29 CT6.4 37.61,11.49 37.2,11.9 37.2,18.15 C6.2 R36.2 37.12,22.72 37.1,22.75 37.1,23.6 39.2,25.7 41.4,25.7 v43.1,27.4 | 20.08,66.42 20.08,70.72 18.1,72.7 | 18.1,72.7 13.5,72.7 12.1,74.1 12.1,76.2 11.5,76.8 7.2,76.8 6.9,76.5 6.9,70.01 CT1.4 | 33.45,67.05 33.45,70.75 31.6,72.6 26.8,72.6 25.2,74.2 25.2,76.1 24.4,76.9 20.5,76.9 19.8,76.2 19.8,74.4 18.1,72.7 | CT4.4 47.8,69.82 47.8,71.8 47,72.6 43.6,72.6 43.5,72.7 43.5,75.1 41.8,76.8 34.6,76.8 33.6,75.8 33.6,67.2 33.45,67.05 | 33.45,65.55 33.45,67.05
  Top 0.813: CT1.4 6.99,64.35 C9.2 | CT2.4 20.08,66.42 21,65.5 21,64.31 C12.2 | CT3.4 33.45,65.55 33.7,65.3 33.7,64.31 C13.2 | CT4.4 47.83,66.17 48.1,65.9 48.1,64.15 C14.2
  Bottom 0.406: v41.9,41.5 46.7,36.7 46.7,31 v43.1,27.4
  pour Top: 65.9,0.2 13.9,0.2 13.9,11.4 65.8,11.4 65.8,11.3 65.9,11.3
D0/RX
  Top 0.406: U1.30 35.58,48.7 31,48.7 29.3,50.4 8.4,50.4 8.17,50.17 JP1.TXO
D1/TX
  Top 0.305: 35.35,47.8 U1.31
  Top 0.406: 35.35,47.8 30.4,47.8 28.7,49.5 13.6,49.5 11.73,47.63 JP1.RXI
D2  (via drill 0.5)
  Top 0.406: U$14.IRQ 62.14,36.66 61.2,37.6 v60.1,37.6 | U1.32 37.56,44.14 v36.6,45.1
  Bottom 0.406: v60.1,37.6 60.1,40.7 64.1,44.7 64.1,53.2 57.9,59.4 54.5,59.4 52.9,57.8 50.7,57.8 39.9,47 36.3,47 35.8,47.5 35.1,47.5 34.4,46.8 34.4,45.9 35.2,45.1 v36.6,45.1
D3
  Top 0.406: SL1.1 27.99,47.51 29.6,45.9 34.01,45.9 U1.1
D4
  Top 0.406: SL1.2 32.43,44.97 36.7,40.7 37.68,40.7 U1.2
D5  (via drill 0.5)
  Top 0.406: SL1.3 33.47,42.43 v35.6,40.3 | U1.9 43.95,36.95 43,36 42,36 v41.6,36.4
  Bottom 0.406: v35.6,40.3 37.7,40.3 v41.6,36.4
D6  (via drill 0.5)
  Top 0.406: SL1.4 33.91,39.89 v34.6,39.2 | U1.10 44.52,38.58 45.3,37.8 45.3,36.5 43.7,34.9 v43,34.9
  Bottom 0.406: v34.6,39.2 37.6,39.2 41.9,34.9 v43,34.9
D7  (via drill 0.5)
  Top 0.406: SL1.5 32.95,37.35 v33.8,38.2 | U1.11 45.1,39.2 46.6,37.7 46.6,35.7 44.4,33.5 v41.4,33.5
  Bottom 0.406: v33.8,38.2 36.7,38.2 v41.4,33.5
D8  (via drill 0.5, 0.6)
  Top 0.406: R10.2 16.13,39.27 16.7,38.7 v30.9,38.7 | U1.12 45.65,39.75 48.3,37.1 48.3,35.8 44.5,32 v41.2,32
  Bottom 0.406: v30.9,38.7 31.3,38.7 32.8,37.2 34,37.2 34.2,37.4 35.1,37.4 40.5,32 v41.2,32
D10
  Top 0.305: R24.1 60.78,39.42 63.1,37.1 63.1,33.5 64.3,32.3 64.3,19.5 U$14.SEL
  Top 0.406: R24.1 57.19,38.49 56.7,38 49.68,38 U1.14
D11/MOSI  (via drill 0.5)
  Top 0.305: v46.7,43 46.71,42.1 U1.15
  Top 0.406: U1.15 48.7,40.1 49.4,40.1 v50,39.5 | U$14.SDI 60.14,26.96 v55.9,31.2
  Bottom 0.305: ISP1.4 52.06,48.47 v46.7,43
  Bottom 0.406: v50,39.5 50,37.1 v55.9,31.2
D12/MISO  (via drill 0.5)
  Top 0.406: U1.16 50.97,42.03 v51.9,41.1
  Top 0.61: ISP1.1 62.67,45.92 64.2,44.4 64.2,35.4 U$14.SDO
  Bottom 0.406: ISP1.1 61.37,44.87 59.3,42.8 53.6,42.8 v51.9,41.1
D13/SCK  (via drill 0.5)
  Top 0.305: v48.7,43.5 48.55,43.5 U1.17
  Top 0.406: U$14.SCK 62.14,26.86 v57.8,31.3
  Bottom 0.305: ISP1.3 61.37,48.27 60.3,47.2 52.4,47.2 v48.7,43.5
  Bottom 0.406: v48.7,43.5 48.7,42.5 52.7,38.5 52.7,36.3 v57.8,31.3
GND  (via drill 0.5, 0.6)
  Top 0.254: D6.A 46.83,50.12 47.75,50.12 54.25,56.62 C8.2
  Top 0.305: 39.01,40.91 40.1,42 40.76,42 | C1.2 51.62,47.72 55.1,51.2 58.63,51.2 ISP1.6 | U1_TQFP.5 40.17,39.77 41,40.6 40.8,41.96 40.76,42 | U1.21 45.65,46.35 42.5,43.2 41.96,43.2 40.76,42
  Top 0.406: D2.A D3.A D4.A D5.A 36.55,49.05 v36.6,49 | 39.01,40.91 U1.3 36.97,38.85 C3.2 35.22,37.88 v34.5,36.5 | D6.A 46.82,47.58 U1.21 | C16.2 47,30.2 U$14.P$12
  Top 0.61: C8.2 56.66,56.63 58.9,54.4 58.9,51.08 ISP1.6 | U$11.2 U$11.2.1 | D7.A 15.9,17.6 15.9,17.1 15.9,13.6 12,9.7 12,7.41 CN1.2 | 7,33.2 13.3,33.2 14.23,32.27 SL1.7 23.01,27.7 29,27.7 29.7,27 C4.2 | v47,17.6 46.98,17.62 D9.A 45.06,24.23 C10.2 46.98,28.84 C16.2 41.26,28.86 39.37,26.97 C11.2 35.93,26.97 v34.5,28.4 33.11,27.01 C4.2 | v56.1,22.3 56.1,19.37 U$14.GND | D8.A 32.03,26.82 C4.2
  Top 1.27: CN1.1 8.66,4.07 CN1.2 4.18,7.32 3.3,9.6 3.3,11 4.1,12.8 4.1,12.9 U$11.2.1 | U$11.2 7.55,20.64 4.6,23.6 4.6,25.19 C18.- 4.57,30.11 S2.3 4.74,30.94 7,33.2 7,38.43 LED1.C
  Bottom 0.406: v34.5,36.5 v34.5,28.4 | v36.6,49 30.2,49 29.3,49.9 29.3,51.2 32.5,54.4 32.5,55.1 31.2,56.4 13.7,56.4 12,54.7
  Bottom 0.61: v47,17.6 51.4,17.6 v56.1,22.3 | JP1.GND 8.91,57.79 12,54.7 12,36.47 16.2,32.27 SL1.7
  pour Bottom: 0.3,77.8 65.6,77.8 65.7,77.8 65.7,0.3 0.3,0.3 0.3,0.4
N$1
  Top 0.406: U1.7 41.27,38.57 41,38.3 41,38.2 38.2,35.4 32.3,35.4 31.9,35 31.9,32.52 Q1.2 31.82,28.73 C4.1
N$2
  Top 1.27: CT1.1 9.48,74.92 9.5,74.9 9.5,68.6 11.5,66.6 13.6,66.6 14,66.2 R19.1
N$3
  Top 0.406: R23.1 37.55,63 | 37.55,63 R21.1 37.55,63.95 | 37.55,63 32.5,63 32.1,63.4 32.1,64.21 C13.1
  Top 0.813: CT3.5 30.75,65.56 C13.1
N$4
  Top 0.406: R13.2 R14.1 38.45,53.8 40.27,51.98 R28.2
N$5
  Top 0.61: U$11.3 3.46,19.23 JP2.1
N$6
  Top 0.61: R29.2 9.47,19.64 U$11.1 9.05,24.9 C18.+
N$7
  Top 0.406: R13.1 33.16,56.64 C17.1
N$8
  Top 1.27: CT4.1 50.3,74.79 50.3,67.4 51,66.7 53.8,66.7 54.2,66.3 54.2,64.38 R26.1
N$9
  Top 0.406: U1.8 41.84,38.04 37.5,33.7 37.5,33.3 Q1.1 36.65,28.74 C11.1
N$10
  Top 1.27: CT2.1 22.48,68.52 23.7,67.3 27.5,67.3 28.1,66.7 28.1,64.36 R20.1
N$11
  Top 0.61: U$14.ANT 52.13,19.55 C29.1
N$12
  Top 0.61: D1.1 10.84,15.36 R29.1
N$13
  Top 1.27: CT3.1 35.85,68.75 37.4,67.2 41,67.2 41.3,66.9 41.3,64.41 R25.1
N$15
  pour Top: 0.2,77.9 65.9,77.9 65.9,77.8 65.8,77.8 65.8,53 0.3,53 0.2,53
N$17
  Top 0.61: CT5.5 25.23,13.2 R27.1 24.59,18.12 C5.1 24.54,22.16 R33.1
N$18
  Top 1.27: CT5.1 20.13,8.97 17.5,11.6 17.5,12.97 R35.1
N$19
  pour Top: 0.4,52.2 65.6,52.2 65.6,12.1 13.7,12.1 13.2,12.1 13.2,0.4 0.4,0.4 0.4,0.6
N$20
  Top 0.203: 54.36,54.9 C8.1
  Top 0.406: C8.1 54.33,53.95 U1.20
N$21
  Top 0.61: CT6.5 40.31,13.45 R38.1 40.31,13.5 39.2,13.5 38.82,13.88 38.82,18.23 C6.1 R36.1
N$22
  Top 1.27: CT6.1 35.21,8.39 32.1,11.5 32.1,12.99 R40.1
N$23
  Top 0.61: C2.2 3.83,43.43 5.4,45 7.31,45 JP1.DTR
N$25
  Top 0.61: CT7.5 55.48,14.08 R43.1 52.85,14.6 C7.1 48.65,14.72 R41.1
N$26
  Top 1.27: CT7.1 50.38,8.62 48.3,10.7 46,10.7 45.1,11.6 45.1,12.83 R45.1
N$33
  Top 0.406: 24.85,62.9 R2.1 24.85,64.25 24.9,64.2 24.9,64.1 | 24.85,62.9 R4.1 | C12.1 19.4,64.21 19.4,63.4 19.8,63 24.75,63 24.85,62.9
  Top 0.813: CT2.5 17.38,66.22 C12.1
N$34
  Top 0.203: 46.02,55 C15.1 | 43.68,55 R12.2 | R11.1 40.94,55 40.9,55.02
  Top 0.254: 38.45,56.42 39.34,56.42 39.72,56.04 39.72,55.15 39.85,55.02 40.9,55.02
  Top 0.406: R14.2 38.45,56.42 | R12.2 R11.1 | 43.68,55 46.02,55
N$37  (via drill 0.6)
  Top 0.406: R15.1 R17.1
  Top 0.61: C14.1 v46.39,61.91 v46.4,61.9 | R17.1 51.9,59.9 v51.8,59.8
  Top 0.813: CT4.5 45.13,65.4 C14.1
  Bottom 0.61: v46.4,61.9 49.7,61.9 v51.8,59.8
N$38
  Top 0.406: R6.1 10.88,63.1 | 10.88,63.1 R1.1 | C9.1 5.37,63.93 6.3,63 10.78,63 10.88,63.1
  Top 0.813: CT1.5 4.29,65.35 C9.1
N$41
  Top 0.61: R10.1 7.67,40.97 LED1.A
RESET  (via drill 0.5)
  Top 0.305: R32.1 49.24,53.05 v48.7,52.5 | v40.8,44.6 40.8,44.61 U1.29
  Top 0.406: R32.1 50.23,54.94 53.8,58.5 57.6,58.5 61.4,54.7 61.4,51.04 ISP1.5 | C2.1 5.17,39.17 5.8,39.8 5.8,41.6 6.7,42.5 9.6,42.5 15.8,48.7 28.2,48.7 29.9,47 35,47 v35.7,46.3
  Top 0.61: S2.1 3.75,39.09 C2.1
  Bottom 0.305: v48.7,52.5 v40.8,44.6
  Bottom 0.406: v35.7,46.3 39.1,46.3 v40.8,44.6

### Text on the board
tPlace: 868Mhz
tSilk: GND | 5V | Tx | Rx | RST | Reset | RFM12B | 9V AC
_tsilk: Designed in | North Wales | Made in UK
_bsilk: SMT V0.6 rev3 | emonTx | wireless energy monitoring node | SMT V0.6 rev3 | emonTx | SMT V0.6 rev3 | emonTx | Technology that helps us live within ecological limits | wireless energy monitoring node | wireless energy monitoring node | Designed in North Wales UK by Glyn Hudson & Trystan Lea | Technology that helps us live within ecological limits | Technology that helps us live within ecological limits | Designed in North Wales UK by Glyn Hudson & Trystan Lea | 165mm ant | 433Mhz | Designed in North Wales UK by Glyn Hudson & Trystan Lea | 165mm ant | 165mm ant | 433Mhz | 433Mhz | 868Mhz | 82mm ant | 82mm ant | 82mm ant | 868Mhz | 868Mhz | 78mm ant | 915Mhz | 78mm ant | 915Mhz | 78mm ant | 915Mhz | 165mm ant | 433Mhz | 82mm ant | 868Mhz | 78mm ant | 915Mhz